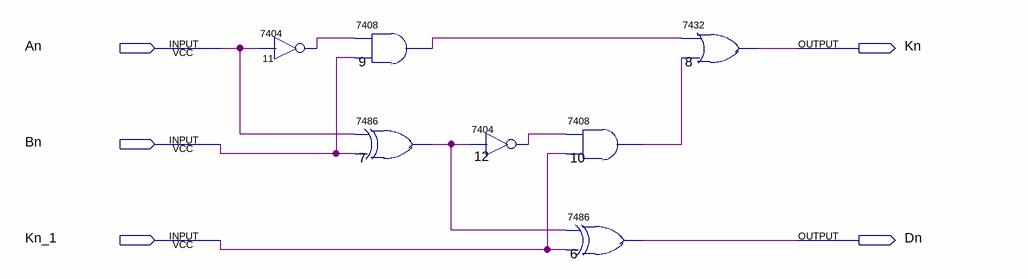
[diagram p0: schematic sheet]
// Quartus schematic Project.bdf as structural Verilog: 7 symbols, 5 pins
module Project (
  input  An,
  input  Bn,
  input  Kn_1,
  output Kn,
  output Dn
);

  wire n7_1, n9_1, n10_1, n11_1, n12_1;

  \7404  u_11 (.\2 (An), .\1 (n11_1));
  \7408  u_9 (.\3 (Bn), .\2 (n11_1), .\1 (n9_1));
  \7486  u_7 (.\2 (An), .\3 (Bn), .\1 (n7_1));
  \7404  u_12 (.\2 (n7_1), .\1 (n12_1));
  \7408  u_10 (.\3 (Kn_1), .\2 (n12_1), .\1 (n10_1));
  \7486  u_6 (.\2 (n7_1), .\3 (Kn_1), .\1 (Dn));
  \7432  u_8 (.\2 (n9_1), .\3 (n10_1), .\1 (Kn));
endmodule
